# EAGLE design untitled (EAGLE 9.6.2)
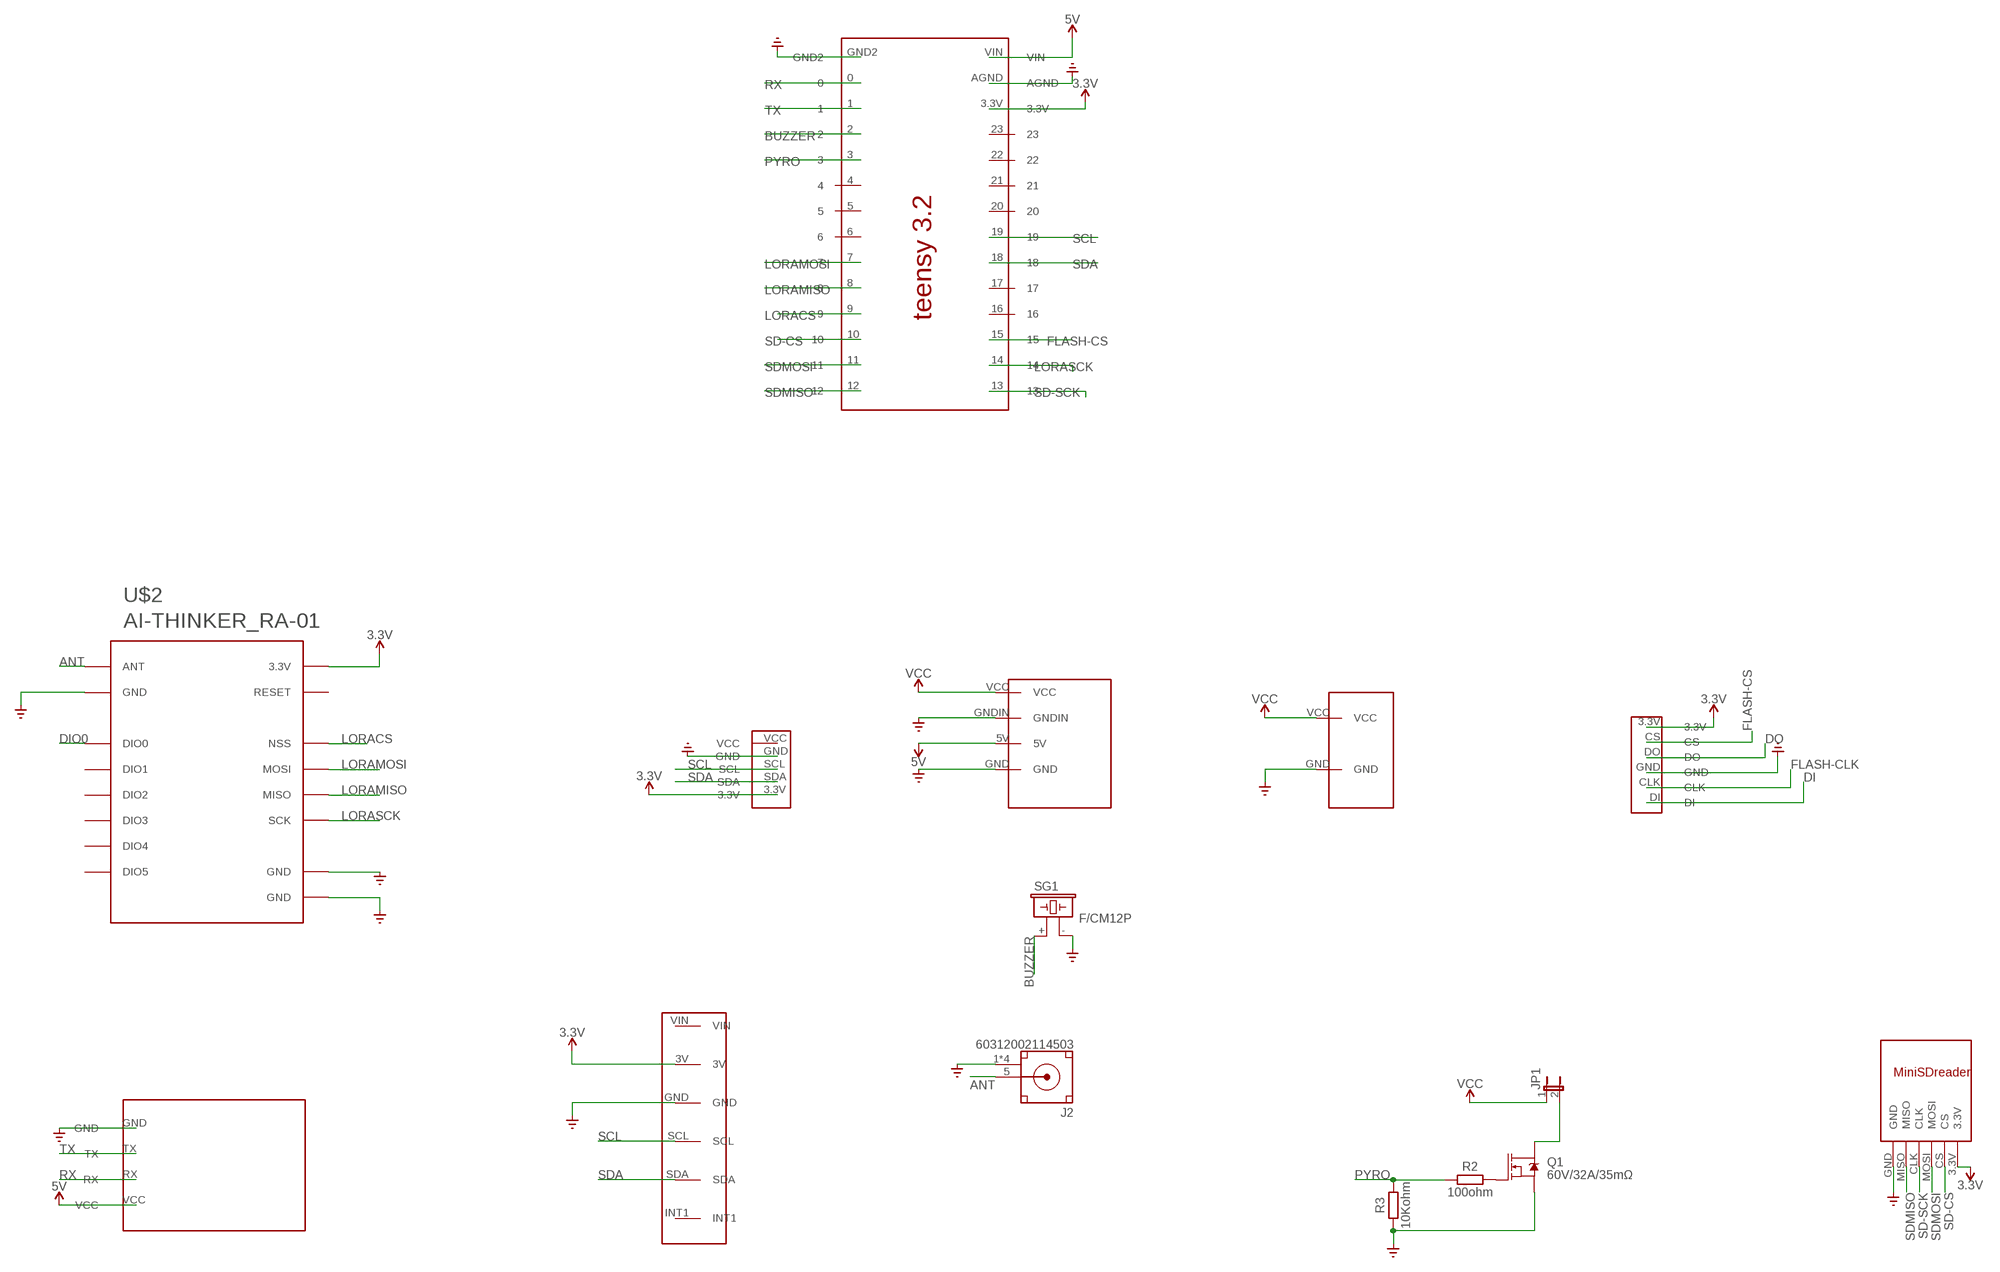
[diagram p0: schematic, sheet 1]

## Parts
J2  60312002114503  [60312002114503]
JP1  JP1E  [JP1]
Q1  60V/32A/35mΩ  MOSFET-NCH-FQP30N06L  [TO220V]
R2  100ohm  R_AXIAL-7.2MM-PITCH  [RESAD724W46L381D178B]
R3  10Kohm  R_AXIAL-7.2MM-PITCH  [RESAD724W46L381D178B]
SG1  F/CM12P  [F/CM12P]
U$1  TEENSY3.2  [TEENSY3.2]
U$2  AI-THINKER_RA-01  [AI-THINKER_RA-01]
U$3  BMP180  [BMP180]
U$4  NEO-M8NGPSMODULE  [NEO-M8NGPSMODULE]
U$5  ICM20649  [ICM20649]
U$6  FLASH  [FLASH]
U$7  MINISDREADER  [MINISDREADER]
U$8  BATT  [BATT]
U$9  VREG  [VREG]

## Nets
3.3V: U$1.3.3V U$2.P$3(3.3V) U$3.3.3V U$5.3V U$6.3.3V U$7.3.3V
5V: U$1.VIN U$4.VCC U$9.5V
ANT: J2.5(SIGNAL) U$2.P$1(ANT)
BUZZER: SG1.+ U$1.2
DI: U$6.DI
DIO0: U$2.P$5(DIO0)
DO: U$6.DO
FLASH-CLK: U$6.CLK
FLASH-CS: U$1.15 U$6.CS
GND: J2.1(GND) J2.2(GND) J2.3(GND) J2.4(GND) Q1.3(S) R3.1 SG1.- U$1.AGND U$1.GND2 U$2.P$2(GND) U$2.P$9(GND) U$2.P$16(GND) U$3.GND U$4.GND U$5.GND U$6.GND U$7.GND U$8.GND U$9.GND U$9.GNDIN ; supply symbol labelled SUPPLY0_GND_
LORACS: U$1.9 U$2.P$15(NSS)
LORAMISO: U$1.8 U$2.P$13(MISO)
LORAMOSI: U$1.7 U$2.P$14(MOSI)
LORASCK: U$1.14 U$2.P$12(SCK)
N$2: JP1.2 Q1.2(D)
N$3: Q1.1(G) R2.2
PYRO: R2.1 R3.2 U$1.3
RX: U$1.0 U$4.RX
SCL: U$1.19 U$3.SCL U$5.SCL
SD-CS: U$1.10 U$7.CS
SD-SCK: U$1.13 U$7.CLK
SDA: U$1.18 U$3.SDA U$5.SDA
SDMISO: U$1.12 U$7.MISO
SDMOSI: U$1.11 U$7.MOSI
TX: U$1.1 U$4.TX
VCC: JP1.1 U$8.VCC U$9.VCC
Unconnected: U$1.4 U$1.5 U$1.6 U$1.16 U$1.17 U$1.20 U$1.21 U$1.22 U$1.23 U$2.P$4(RESET) U$2.P$6(DIO1) U$2.P$7(DIO2) U$2.P$8(DIO3) U$2.P$10(DIO4) U$2.P$11(DIO5) U$3.VCC U$5.INT1 U$5.VIN

## Library data of the parts
J2 = Coaxial Connectors:60312002114503: SMA PCB THT JACK STRAIGHT WR-SMA Manufacturer's datasheet <https://katalog.we-online.de/em/datasheet/60312002114503.pdf>; CREATED_BY: PCBLayout.com; DIGIKEY_PART_NUMBER: 732-13835-ND; MANUFACTURER: Wurth Electronics Inc.; MPN: 60312002114503
JP1 = jumper:JP1E: JUMPER
Q1 = SparkFun-DiscreteSemi:MOSFET-NCH: N-channel MOSFETs Voltage controlled devices that allow control of high current outputs. SparkFun Products: SparkFun OpenScale <https://www.sparkfun.com/products/13261> SparkFun Digital Sandbox <https://www.sparkfun.com/products/12651> SparkFun Monster Moto Shield <https://www.sparkfun.com/products/10182> SparkFun MOSFET Power Controller <https://www.sparkfun.com/products/11214>; PROD_ID: TRANS-10060
R2 R3 = Resistor:R: Resistor Fixed - Generic; CATEGORY: Resistor; SUB-CATEGORY: Fixed
SG1 = buzzer:F/CM12P: BUZZER Source: Buerklin; OC_FARNELL: unknown; OC_NEWARK: unknown
U$1 = teensy3.2:TEENSY3.2
U$2 = LoRa_modules:AI-THINKER_RA-01
U$3 = bmp180:BMP180
U$4 = gpsneom8nsymbol:NEO-M8NGPSMODULE
U$5 = icm20649:ICM20649
U$6 = flash:FLASH
U$7 = minisdreader:MINISDREADER
U$8 = batt:BATT
U$9 = vreg:VREG

## Board
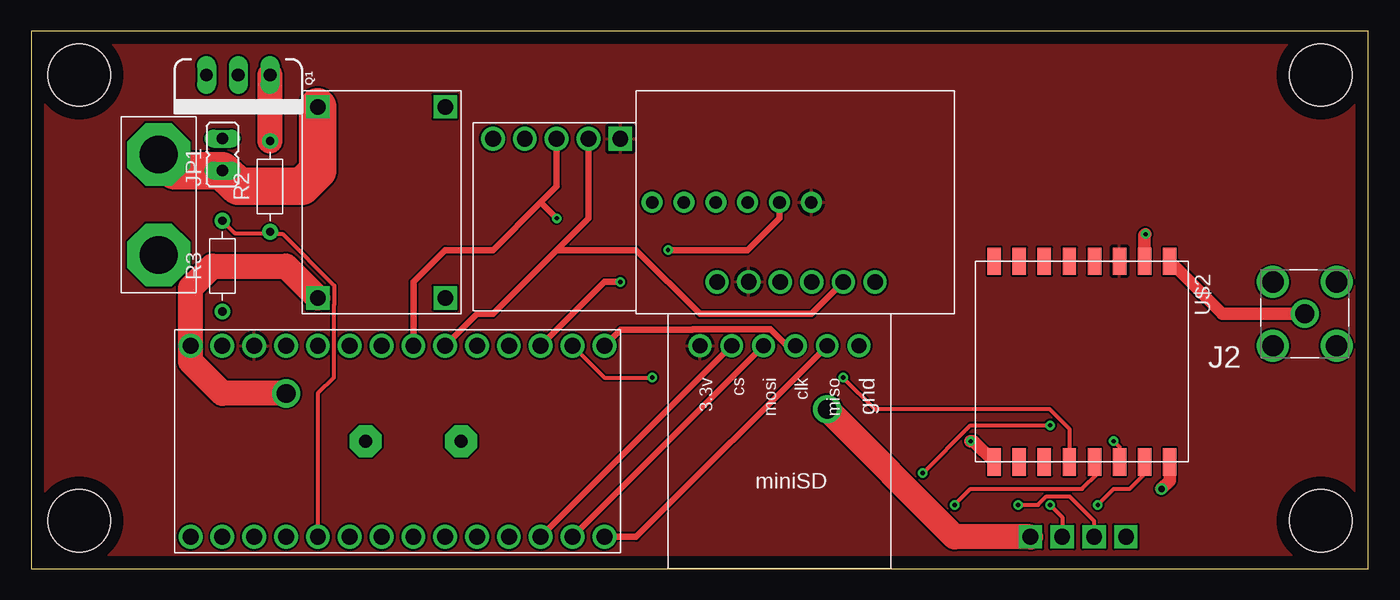
[diagram p1: board, top side]
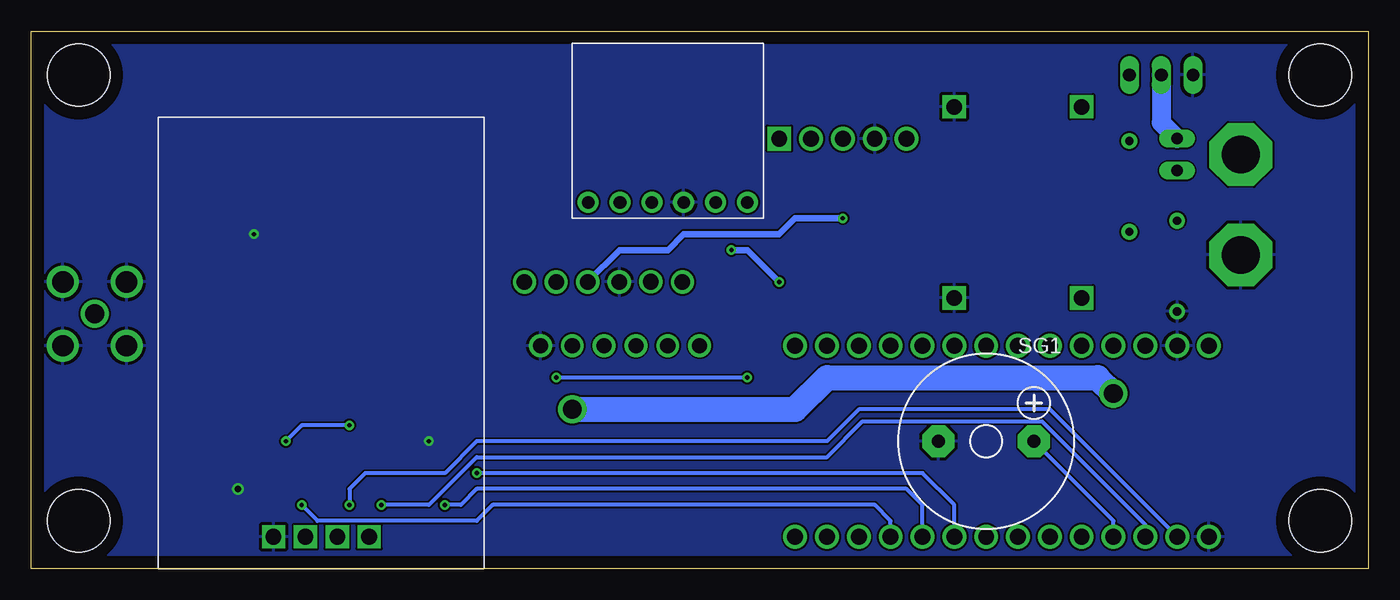
[diagram p2: board, bottom side, seen from below]

Size 106.66 x 42.85 mm. Coordinates in mm from the lower left corner, seen from the top.
Outline: 0,0 106.66,0 106.66,42.85 0,42.85 0,0
Copper layers (1*16): Top 0.035mm / dielectric 0.15mm / Bottom 0.035mm
Design rules "default": minimum track width 6mil, minimum drill 0.35mm, track to track 6mil, track to pad 6mil, pad to pad 6mil, via to via 6mil, smd to smd 6mil, copper to edge 40mil, drill to drill 6mil, minimum pad ring 10mil, minimum via ring 8mil, stop-mask expansion 4mil, vias tented up to drill 0mil, thermal gap 10mil
Holes 5 mm at 3.81,39.37 3.81,3.81 102.87,3.81 102.87,39.37

### Footprints (pad centres in the part's own frame; a part is rotated, then mirrored left to right if it is on the bottom)
60312002114503 = drill 1.7: 1 -2.54,2.54; 2 2.54,2.54; 3 -2.54,-2.54; 4 2.54,-2.54 | drill 1.5: 5 0,0
JP1 = drill 0.914 long: 1 0,-1.27; 2 0,1.27
TO220V = drill 1.016 long: 1 -2.54,0; 2 0,0; 3 2.54,0
RESAD724W46L381D178B = drill 0.66 pad 1.26: 1 -3.62,0; 2 3.62,0
F/CM12P = drill 1.016 pad 2.54 octagon: + 3.81,0; - -3.81,0
TEENSY3.2 = drill 1.27: 0 3.81,-16.51; 1 6.35,-16.51; 2 8.89,-16.51; 3 11.43,-16.51; 3.3V 6.35,-1.27; 4 13.97,-16.51; 5 16.51,-16.51; 6 19.05,-16.51; 7 21.59,-16.51; 8 24.13,-16.51; 9 26.67,-16.51; 10 29.21,-16.51; 11 31.75,-16.51; 12 34.29,-16.51; 13 34.29,-1.27; 14 31.75,-1.27; 15 29.21,-1.27; 16 26.67,-1.27; 17 24.13,-1.27; 18 21.59,-1.27; 19 19.05,-1.27; 20 16.51,-1.27; 21 13.97,-1.27; 22 11.43,-1.27; 23 8.89,-1.27; AGND 3.81,-1.27; GND2 1.27,-16.51; VIN 1.27,-1.27
AI-THINKER_RA-01 = smd 2.184 x 1.067: P$1 -8,7; P$2 -8,5; P$3 -8,3; P$4 -8,1; P$5 -8,-1; P$6 -8,-3; P$7 -8,-5; P$8 -8,-7; P$9 8,-7; P$10 8,-5; P$11 8,-3; P$12 8,-1; P$13 8,1; P$14 8,3; P$15 8,5; P$16 8,7
BMP180 = drill 1.27 square: 3.3V 1.27,1.27 | drill 1.27: GND 8.89,1.27; SCL 6.35,1.27; SDA 3.81,1.27; VCC 11.43,1.27
NEO-M8NGPSMODULE = drill 1.24 square: GND 9.19,2.54; RX 14.27,2.54; TX 11.73,2.54; VCC 16.81,2.54
ICM20649 = drill 1.24 pad 1.78: 3V 2.56,16.43; GND 2.54,13.91; INT1 2.54,6.35; SCL 2.54,11.39; SDA 2.54,8.87; VIN 2.54,18.95
FLASH = drill 1 pad 1.676: 3.3V 1.27,13.97; CLK 1.27,3.81; CS 1.27,11.43; DI 1.27,1.27; DO 1.27,8.89; GND 1.27,6.35
MINISDREADER = drill 1.212 pad 1.411: 3.3V 15.24,-17.78; CLK 7.62,-17.78; CS 12.7,-17.78; GND 2.54,-17.78; MISO 5.08,-17.78; MOSI 10.16,-17.78
BATT = drill 3 pad 5 octagon: GND 8,0; VCC 0,0
VREG = drill 1.24 square: 5V 3.81,16.51; GND 13.97,16.51; GNDIN 13.97,31.75; VCC 3.81,31.75

### Placement (x,y rotation side)
J2  101.6,20.32 180 top
JP1  15.24,33.02 0 top
Q1  16.51,39.37 180 top
R2  19.05,30.48 90 top
R3  15.24,24.13 90 top
SG1  30.48,10.16 0 bottom
U$1  11.43,19.05 0 top
U$2  83.82,16.51 270 top
U$3  48.26,35.56 180 top
U$4  96.52,0 0 bottom
U$5  73.66,20.32 90 top
U$6  48.26,27.94 90 bottom
U$7  68.58,0 180 top
U$8  10.16,33.02 270 top
U$9  19.05,5.08 0 top

### Tracks (layer width: path | path; a pad name or v marks a point on that pad's centre or on a via)
3.3V
  pour Top: -3.81,46.99 -3.81,-2.54 -2.54,-3.81 107.95,-3.81 107.95,44.45 104.14,48.26 -3.81,48.26
5V  (via drill 1.5)
  Top 2: U$9.5V 20.32,24.13 14.44,24.13 12.7,22.39 U$1.VIN 12.7,16.51 15.24,13.97 v20.32,13.97 | U$4.VCC 73.66,2.54 v63.5,12.7
  Bottom 2: v20.32,13.97 21.59,15.24 43.18,15.24 45.72,12.7 v63.5,12.7
ANT
  Top 1: J2.5 95.01,20.32 U$2.P$1
BUZZER
  Bottom 0.3: U$1.2 20.32,3.81 SG1.+
FLASH-CS  (via drill 0.35)
  Top 0.5: U$1.15 45.72,22.86 v46.99,22.86 | v50.8,25.4 57.15,25.4 59.69,27.94 U$6.CS
  Bottom 0.5: v46.99,22.86 49.53,25.4 v50.8,25.4
GND  (via drill 0.35, 0.5)
  Top 1: U$2.P$16 90.82,7 v90.17,6.35 | U$2.P$9 75.17,10.16 v74.93,10.16 | U$2.P$2 88.82,26.59 v88.9,26.67
  pour Bottom: -3.81,48.26 -3.81,-5.08 109.22,-5.08 109.22,45.72 106.68,48.26
LORACS  (via drill 0.35)
  Top 0.3: v85.09,5.08 86.36,6.35 87.63,6.35 88.82,7.54 U$2.P$15
  Bottom 0.3: U$1.9 38.1,3.81 39.37,5.08 69.85,5.08 71.12,3.81 83.82,3.81 v85.09,5.08
LORAMISO  (via drill 0.35)
  Top 0.3: v73.66,5.08 74.93,6.35 83.82,6.35 85.09,7.62 85.09,8.24 U$2.P$13
  Bottom 0.3: U$1.8 35.56,5.08 36.83,6.35 71.12,6.35 72.39,5.08 v73.66,5.08
LORAMOSI  (via drill 0.35)
  Top 0.3: v71.12,7.62 74.93,11.43 v81.28,11.43 | v86.36,10.16 86.82,9.7 U$2.P$14
  Bottom 0.3: U$1.7 33.02,5.08 35.56,7.62 v71.12,7.62 | v81.28,11.43 85.09,11.43 v86.36,10.16
LORASCK  (via drill 0.35)
  Top 0.3: U$1.14 45.72,15.24 v49.53,15.24 | v64.77,15.24 67.31,12.7 81.28,12.7 82.82,11.16 U$2.P$12
  Bottom 0.3: v49.53,15.24 v64.77,15.24
N$2
  Bottom 1.5: Q1.2 16.51,35.56 JP1.2
N$3
  Top 2: R2.2 Q1.1
PYRO
  Top 0.3: R2.1 19.14,26.77 | 19.14,26.77 19.21,26.7 20.04,26.7 24.16,22.57 24.16,21.05 24.13,21.02 24.13,15.24 22.86,13.97 U$1.3 | R3.2 16.22,26.77 19.14,26.77
RX  (via drill 0.35)
  Top 0.3: v81.28,5.08 82.25,4.11 U$4.RX
  Bottom 0.3: U$1.0 25.4,12.7 40.64,12.7 43.18,10.16 71.12,10.16 73.66,7.62 80.01,7.62 81.28,6.35 v81.28,5.08
SCL  (via drill 0.35)
  Top 0.5: U$1.19 30.48,22.86 33.02,25.4 36.83,25.4 40.64,29.21 | U$3.SCL 41.91,30.48 40.64,29.21 | 40.64,29.21 v41.91,27.94
  Bottom 0.5: v41.91,27.94 45.72,27.94 46.99,26.67 54.61,26.67 55.88,25.4 59.73,25.4 U$5.SCL
SD-CS
  Top 0.5: U$1.10 U$7.CS
SD-SCK
  Top 0.5: U$7.CLK 60.27,17.78 58.96,19.09 52.8,19.09 52.76,19.05 46.99,19.05 U$1.13
SDA
  Top 0.5: U$1.18 35.56,20.32 36.83,20.32 41.91,25.4 | 41.91,25.4 44.45,27.94 U$3.SDA | 41.91,25.4 48.26,25.4 53.34,20.32 62.25,20.32 U$5.SDA
SDMISO
  Top 0.5: U$7.MISO 48.26,2.54 U$1.12
SDMOSI
  Top 0.5: U$7.MOSI U$1.11
TX  (via drill 0.35)
  Top 0.3: U$4.TX 84.79,3.81 82.84,5.76 81,5.76 80.32,5.08 v78.74,5.08
  Bottom 0.3: U$1.1 17.78,3.49 26.02,11.73 40.34,11.73 43.18,8.89 71.12,8.89 74.93,5.08 v78.74,5.08
VCC
  Top 3: U$9.VCC 22.86,31.75 21.59,30.48 16.51,30.48 JP1.1 11.43,31.75 U$8.VCC